# Altium schematic sheet Cover_Page.SchDoc
size A4; SheetNumber: 1; SheetTotal: 4
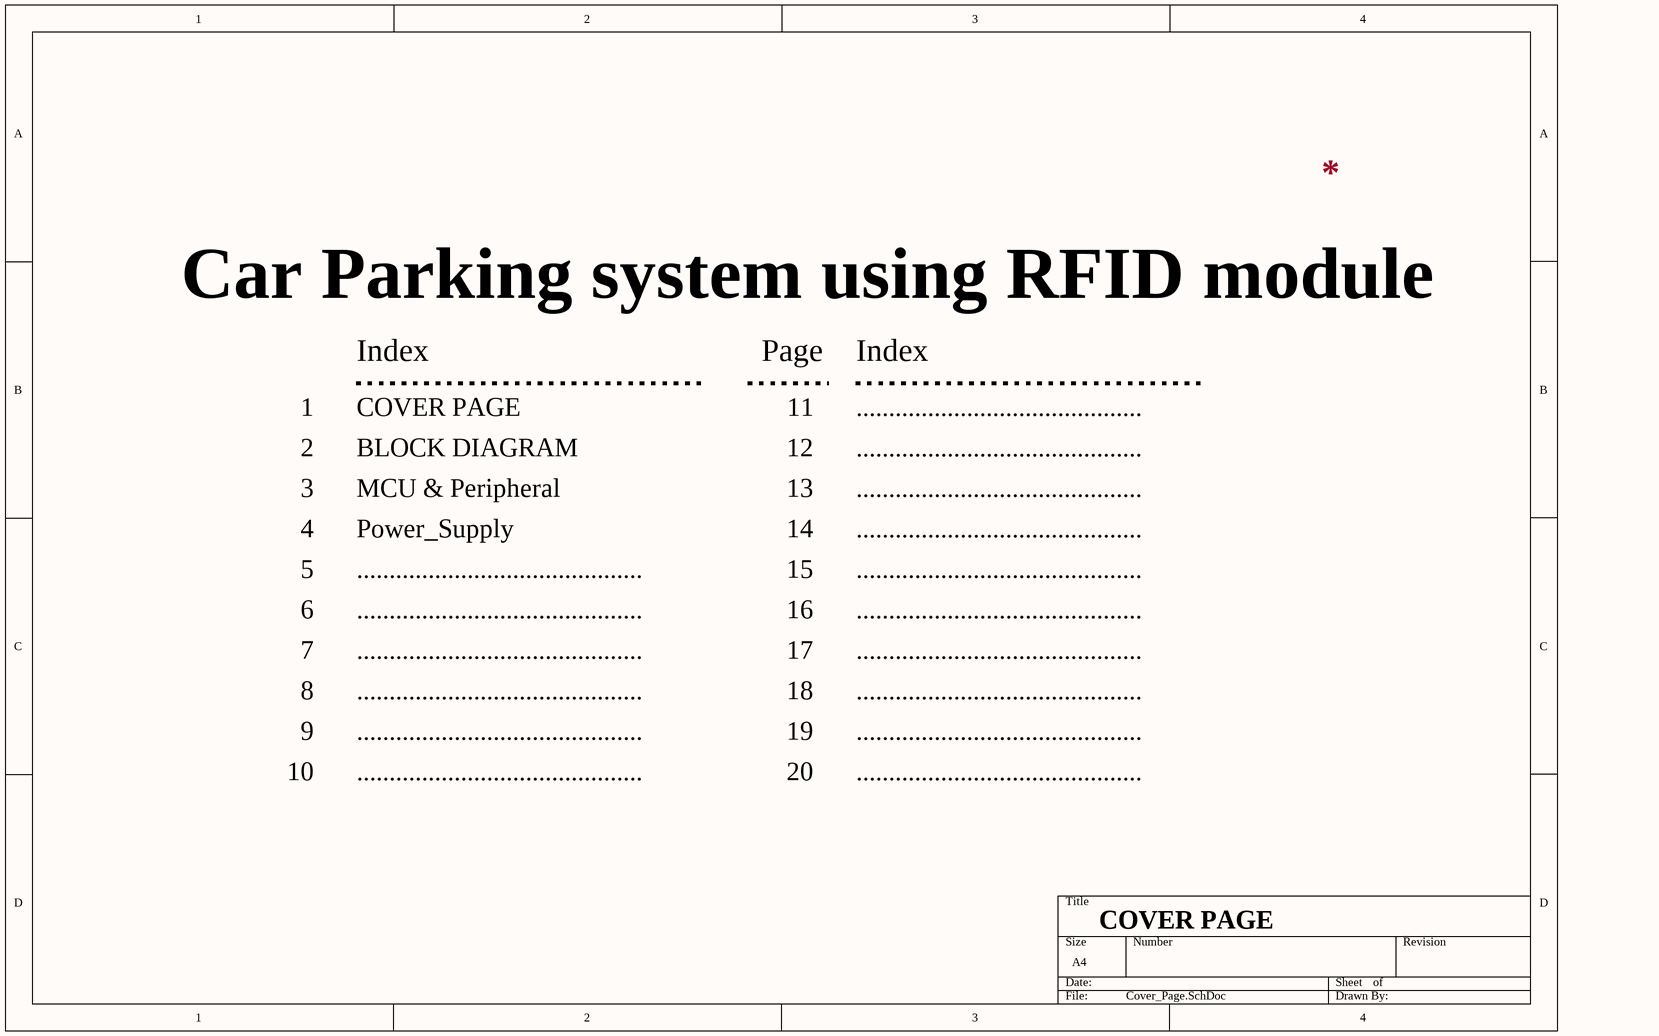
[diagram p0: Cover_Page.SchDoc]

## Notes on the sheet
- Car Parking system using RFID module
- Index
- Page
- 1
- COVER PAGE
- 11
- ............................................
- 2
- 3
- BLOCK DIAGRAM
- MCU & Peripheral
- 12
- 13
- 4
- 5
- Power_Supply
- 14
- 15
- 6
- 16
- 7
- 8
- 17
- 18
- 9
- 10
- 19
- 20